# Altium schematic sheet 08_Power_Supply.SchDoc
size A4; SheetNumber: 8; SheetTotal: 9
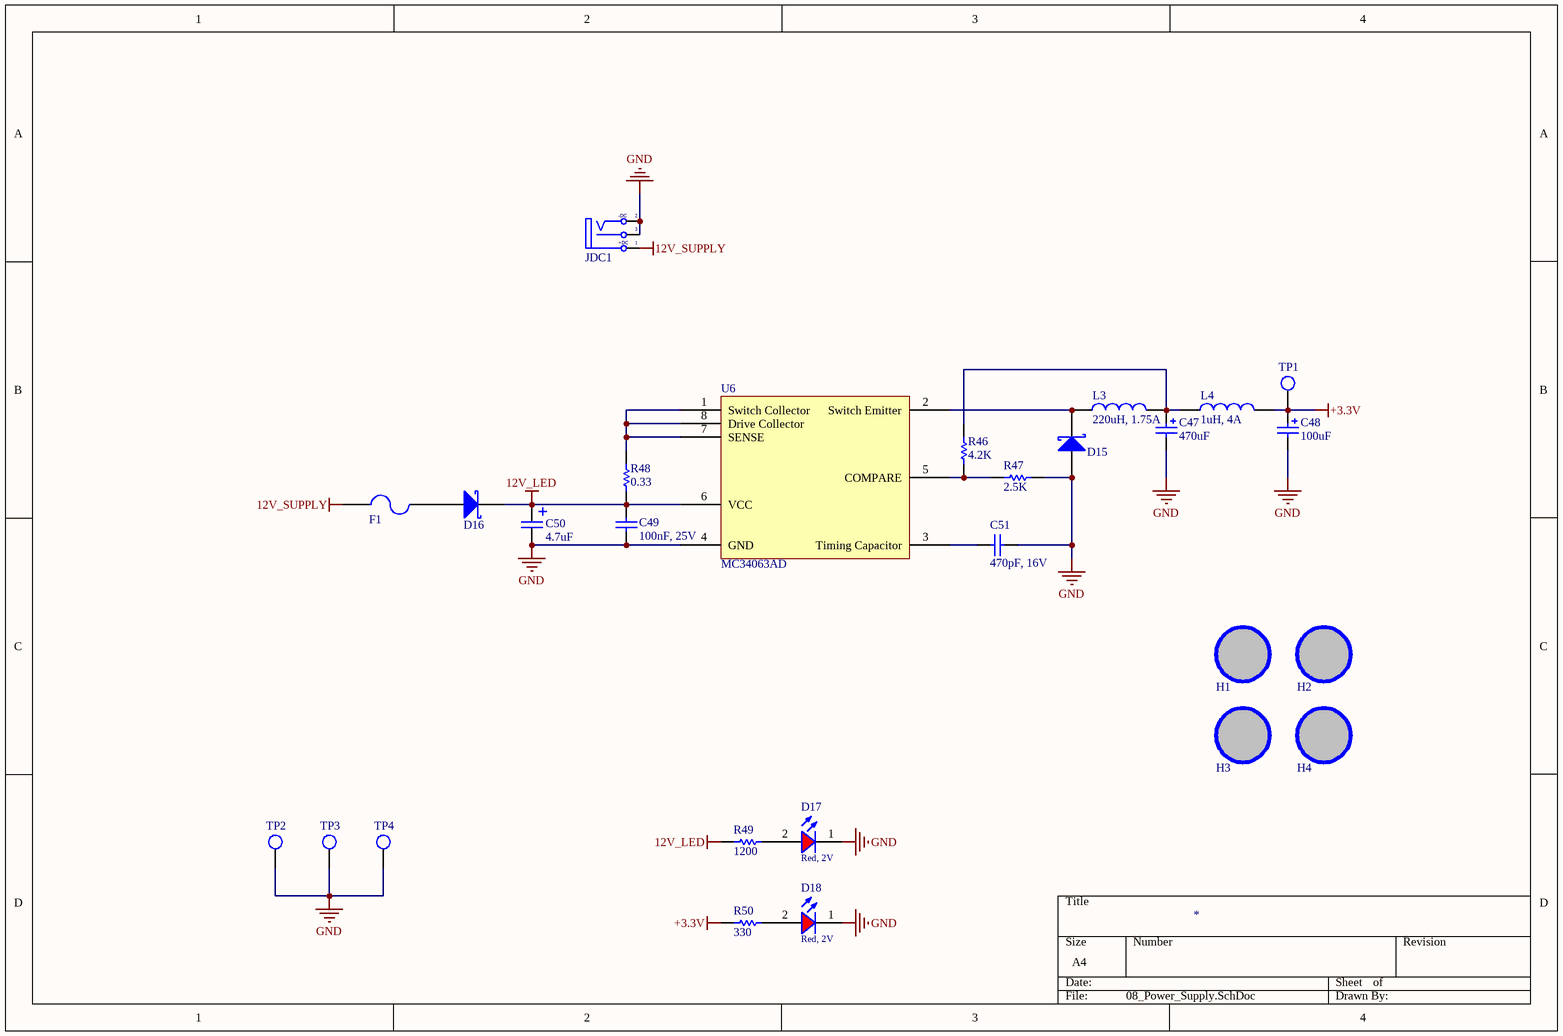
[diagram p0: 08_Power_Supply.SchDoc]

## Parts
C47  value 470uF  [CAP ALU SIZE F]  (hidden comment: Cap Pol SMD)
C48  value 100uF  [CAP ALU SIZE D]  (hidden comment: Cap Pol SMD)
C49  100nF, 25V  [WCAP-CSGP_0603_H=0.8mm_Reflow]
C50  value 4.7uF  [CAPMP3216X18N]  (hidden comment: Tantalum Capacitor)
C51  470pF, 16V  [WCAP-CSGP_0603_H=0.8mm_Reflow]
D15  D Schottky  [SS34]  (value not drawn)
D16  D Schottky  [SS34]  (value not drawn)
D17  Red, 2V  [WL-SMCW_0603_H=0.7mm]
D18  Red, 2V  [WL-SMCW_0603_H=0.7mm]
F1  Fuse  [FUSE SMD]  (value not drawn)
H1  Hole  [LO KHOAN 3MM]  (value not drawn)
H2  Hole  [LO KHOAN 3MM]  (value not drawn)
H3  Hole  [LO KHOAN 3MM]  (value not drawn)
H4  Hole  [LO KHOAN 3MM]  (value not drawn)
JDC1  Jack DC  [DC-IN]  (value not drawn)
L3  220uH, 1.75A  [WE-PD2A_5848]
L4  1uH, 4A  [WE-PD2A_4532]
R46  value 4.2K  [RES-SM-0603]  (hidden comment: RESISTOR SMD)
R47  value 2.5K  [RES-SM-0603]  (hidden comment: RESISTOR SMD)
R48  value 0.33  [RES-SM-0805]  (hidden comment: RESISTOR SMD)
R49  value 1200  [RES-SM-0603]  (hidden comment: RESISTOR SMD)
R50  value 330  [RES-SM-0603]  (hidden comment: RESISTOR SMD)
TP1  Test point  [TP]  (value not drawn)
TP2  Test point  [TP]  (value not drawn)
TP3  Test point  [TP]  (value not drawn)
TP4  Test point  [TP]  (value not drawn)
U6  MC34063AD  [SOIC127P600X170-8N]

## Nets
12V_LED: C49.2 C50.1 D16.2(K) R48.1 R49.2 U6.6(VCC)
12V_SUPPLY: F1.1 JDC1.1(T)
+3.3V: C48.1 L4.2 R50.2 TP1.1
GND: C47.2 C48.2 C49.1 C50.2 C51.2 D15.1(A) D17.1(K) D18.1(K) JDC1.2(TN) JDC1.3(S) R47.1 TP2.1 TP3.1 TP4.1 U6.4(GND)
NetC47_1: C47.1 L3.2 L4.1 R46.2
NetC51_1: C51.1 U6.3(Timing_Capacitor)
NetD15_2: D15.2(K) L3.1 U6.2(Switch_Emitter)
NetD16_1: D16.1(A) F1.2
NetD17_2: D17.2(A) R49.1
NetD18_2: D18.2(A) R50.1
NetR46_1: R46.1 R47.2 U6.5(COMPARE)
NetR48_2: R48.2 U6.1(Switch_Collector) U6.7(SENSE) U6.8(Drive_Collector)

Not connected (* = marked no-connect by the designer): H1 1; H2 1; H3 1; H4 1

## Notes on the sheet
- (in symbol Jack DC) -DC; +DC

## Library data of the parts
C47 C48 = Cap Pol SMD: Polarized Capacitor (Radial)
C49 = 885012206071: WCAP-CSGP Multilayer Ceramic Chip Capacitor, General Purpose, size 0603, X7R, 100nF, 25V; Manufacturer: Wurth Elektronik; Rated Voltage: 25VDC; Isolation Resistance: >=5GOhm; Capacitance Tolerance: +/-10%; Technical Reference: X7R0603104K025DFCT10000; ComponentLink1Description: Manufacturer; ComponentLink1URL: http://www.we-online.de; ComponentLink2Description: Datasheet; ComponentLink2URL: https://www.we-online.com/catalog/datasheet/885012206071.pdf; Operating Temperature: -55 to +125degC; Packaging: Tape and Reel; Manufacturer Part Number: 885012206071; Published Date: May 2020; Ceramic Type: X7R; Dissipation Factor: =<3.5%; Height: 0.8mm; Mounting Technology: SMT; Size: 0603; Capacitance: 100nF
C51 = 885012006027: WCAP-CSGP Multilayer Ceramic Chip Capacitor, General Purpose, size 0603, NP0, 470pF, 16V; Manufacturer: Wurth Elektronik; Rated Voltage: 16VDC; Isolation Resistance: >=10GOhm; Capacitance Tolerance: +/-5%; Dissipation Factor: Q>=1000; Technical Reference: NP00603471J016DFCT10000; ComponentLink1Description: Manufacturer; ComponentLink1URL: http://www.we-online.de; ComponentLink2Description: Datasheet; ComponentLink2URL: https://www.we-online.com/catalog/datasheet/885012006027.pdf; Operating Temperature: -55 to +125degC; Packaging: Tape and Reel; Manufacturer Part Number: 885012006027; Published Date: May 2020; Ceramic Type: NP0; Height: 0.8mm; Mounting Technology: SMT; Size: 0603; Capacitance: 470pF
D15 D16 = D Schottky: Schottky Diode; Published: 8-Jun-2000; LatestRevisionDate: 17-Jul-2002; LatestRevisionNote: Re-released for DXP Platform.; PackageReference: SMB; Publisher: Altium Limited; PackageDescription: DO-214-AA/SMB; 2 C-Bend Leads; Body 5.3 x 3.6 mm, inc. leads (LxW); Code_JEDEC: DO-214-AA
D17 D18 = 150060RS75000: WL-SMCW SMT Mono-color Chip LED Waterclear, size 0603, Red, 2V, 140deg; Chip Technology: AlInGaP; Dominant Wavelength typ.: 625nm; Luminous Intensity typ.: 250mcd; Peak Wavelength typ.: 630nm; Viewing Angle: 140deg; ComponentLink1Description: Manufacturer; ComponentLink1URL: http://www.we-online.de; ComponentLink2URL: https://www.we-online.com/catalog/datasheet/150060RS75000.pdf; ComponentLink2Description: Datasheet; Forward Voltage typ.: 2V; Emitting Color: Red; Mounting Technology: SMT; Operating Temperature: -40 to +85degC; Published Date: December 2019; Part Number: 150060RS75000; Packaging: Tape and Reel; Size: 0603; Publisher: Wurth Elektronik
H1-H4 = Hole: Hole 3mm
JDC1 = Jack DC: Jack DC input; Value: Jac DC
L3 = 784774222: WE-PD2A SMT Power Inductor, size 5848, 220uH, 0.41A; Manufacturer: Wurth Elektronik; DC Resistance max.: 1.57Ohm; Saturation Current: 0.47A; Self Resonant Frequency: 5MHz; DC Resistance typ.: 0.945Ohm; Rated Voltage: 80VDC; ComponentLink1Description: Manufacturer; ComponentLink1URL: http://www.we-online.de; ComponentLink2Description: Datasheet; ComponentLink2URL: https://www.we-online.com/catalog/datasheet/784774222.pdf; Manufacturer Part Number: 784774222; Published Date: May 2020; Rated Current: 0.41A; Inductance: 220uH; Operating Temperature: -40 to +125degC; Mounting Technology: SMT; Packaging: Tape and Reel; Size: 5848
L4 = 7847730: WE-PD2A SMT Power Inductor, size 4532, 1uH, 4A; Manufacturer: Wurth Elektronik; DC Resistance max.: 0.049Ohm; Saturation Current: 5.72A; Self Resonant Frequency: 110MHz; DC Resistance typ.: 0.014Ohm; Rated Voltage: 80VDC; ComponentLink1Description: Manufacturer; ComponentLink1URL: http://www.we-online.de; ComponentLink2Description: Datasheet; ComponentLink2URL: https://www.we-online.com/catalog/datasheet/7847730.pdf; Manufacturer Part Number: 7847730; Published Date: May 2020; Rated Current: 4A; Inductance: 1uH; Operating Temperature: -40 to +125degC; Mounting Technology: SMT; Packaging: Tape and Reel; Size: 4532
R46-R50 = RESISTOR SMD: Resistor
TP1-TP4 = TP: ComponentLink1Description: Supplier 1 Link
U6 = MC34063: 1.5-A boost, buck, inverting switching regulator, operation from 0°C to 70°C; Manufacturer: Texas Instruments; ComponentLink1Description: Local Supplier Link; ComponentLink1URL: https://www.thegioiic.com/products/mc34063ad-ic-dieu-chinh-tang-giam-ap-1-5a-8-soic; Local Supplier: Thegioiic; Local Supplier P/N: MC34063AD; Manufacturer P/N: MC34063AD